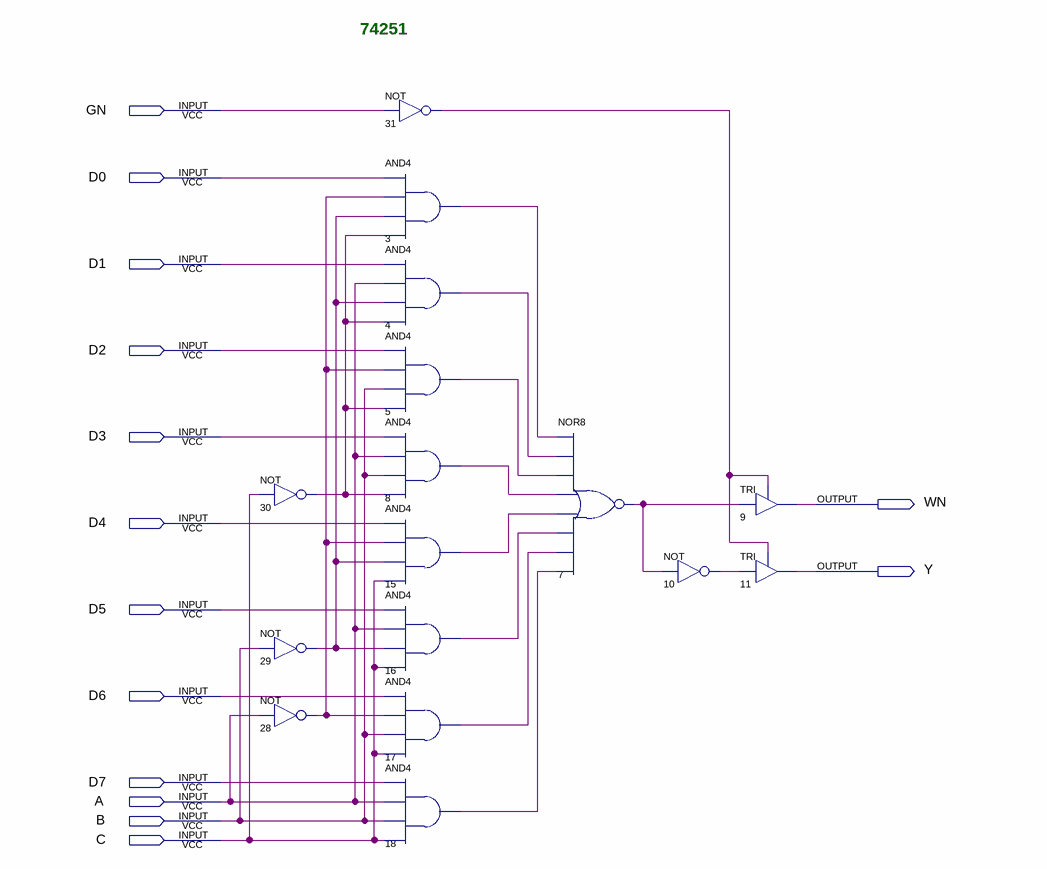
[diagram p0: schematic sheet]
// Quartus schematic 74251.bdf as structural Verilog: 16 symbols, 14 pins
module \74251  (
  input  GN,
  input  D0,
  input  D1,
  input  D2,
  input  D3,
  input  D4,
  input  D5,
  input  D6,
  input  D7,
  input  A,
  input  B,
  input  C,
  output WN,
  output Y
);

  wire n3_out, n4_out, n5_out, n7_out, n8_out, n10_out, n15_out, n16_out, n17_out, n18_out, n28_out, n29_out,
       n30_out, n31_out;

  not u_30 (n30_out, C);
  not u_29 (n29_out, B);
  not u_28 (n28_out, A);
  not u_31 (n31_out, GN);
  and u_3 (n3_out, D0, n28_out, n29_out, n30_out);
  and u_4 (n4_out, D1, A, n29_out, n30_out);
  and u_5 (n5_out, D2, n28_out, B, n30_out);
  and u_8 (n8_out, D3, A, B, n30_out);
  and u_15 (n15_out, D4, n28_out, n29_out, C);
  and u_16 (n16_out, D5, A, n29_out, C);
  and u_17 (n17_out, D6, n28_out, B, C);
  and u_18 (n18_out, D7, A, B, C);
  nor u_7 (n7_out, n3_out, n4_out, n5_out, n8_out, n15_out, n16_out, n17_out, n18_out);
  not u_10 (n10_out, n7_out);
  TRI u_9 (.IN(n7_out), .OE(n31_out), .OUT(WN));
  TRI u_11 (.IN(n10_out), .OE(n31_out), .OUT(Y));

  // Notes on the sheet:
  //   74251
endmodule
